# EAGLE design mSD-Shield_v20 (EAGLE 7.5.0)
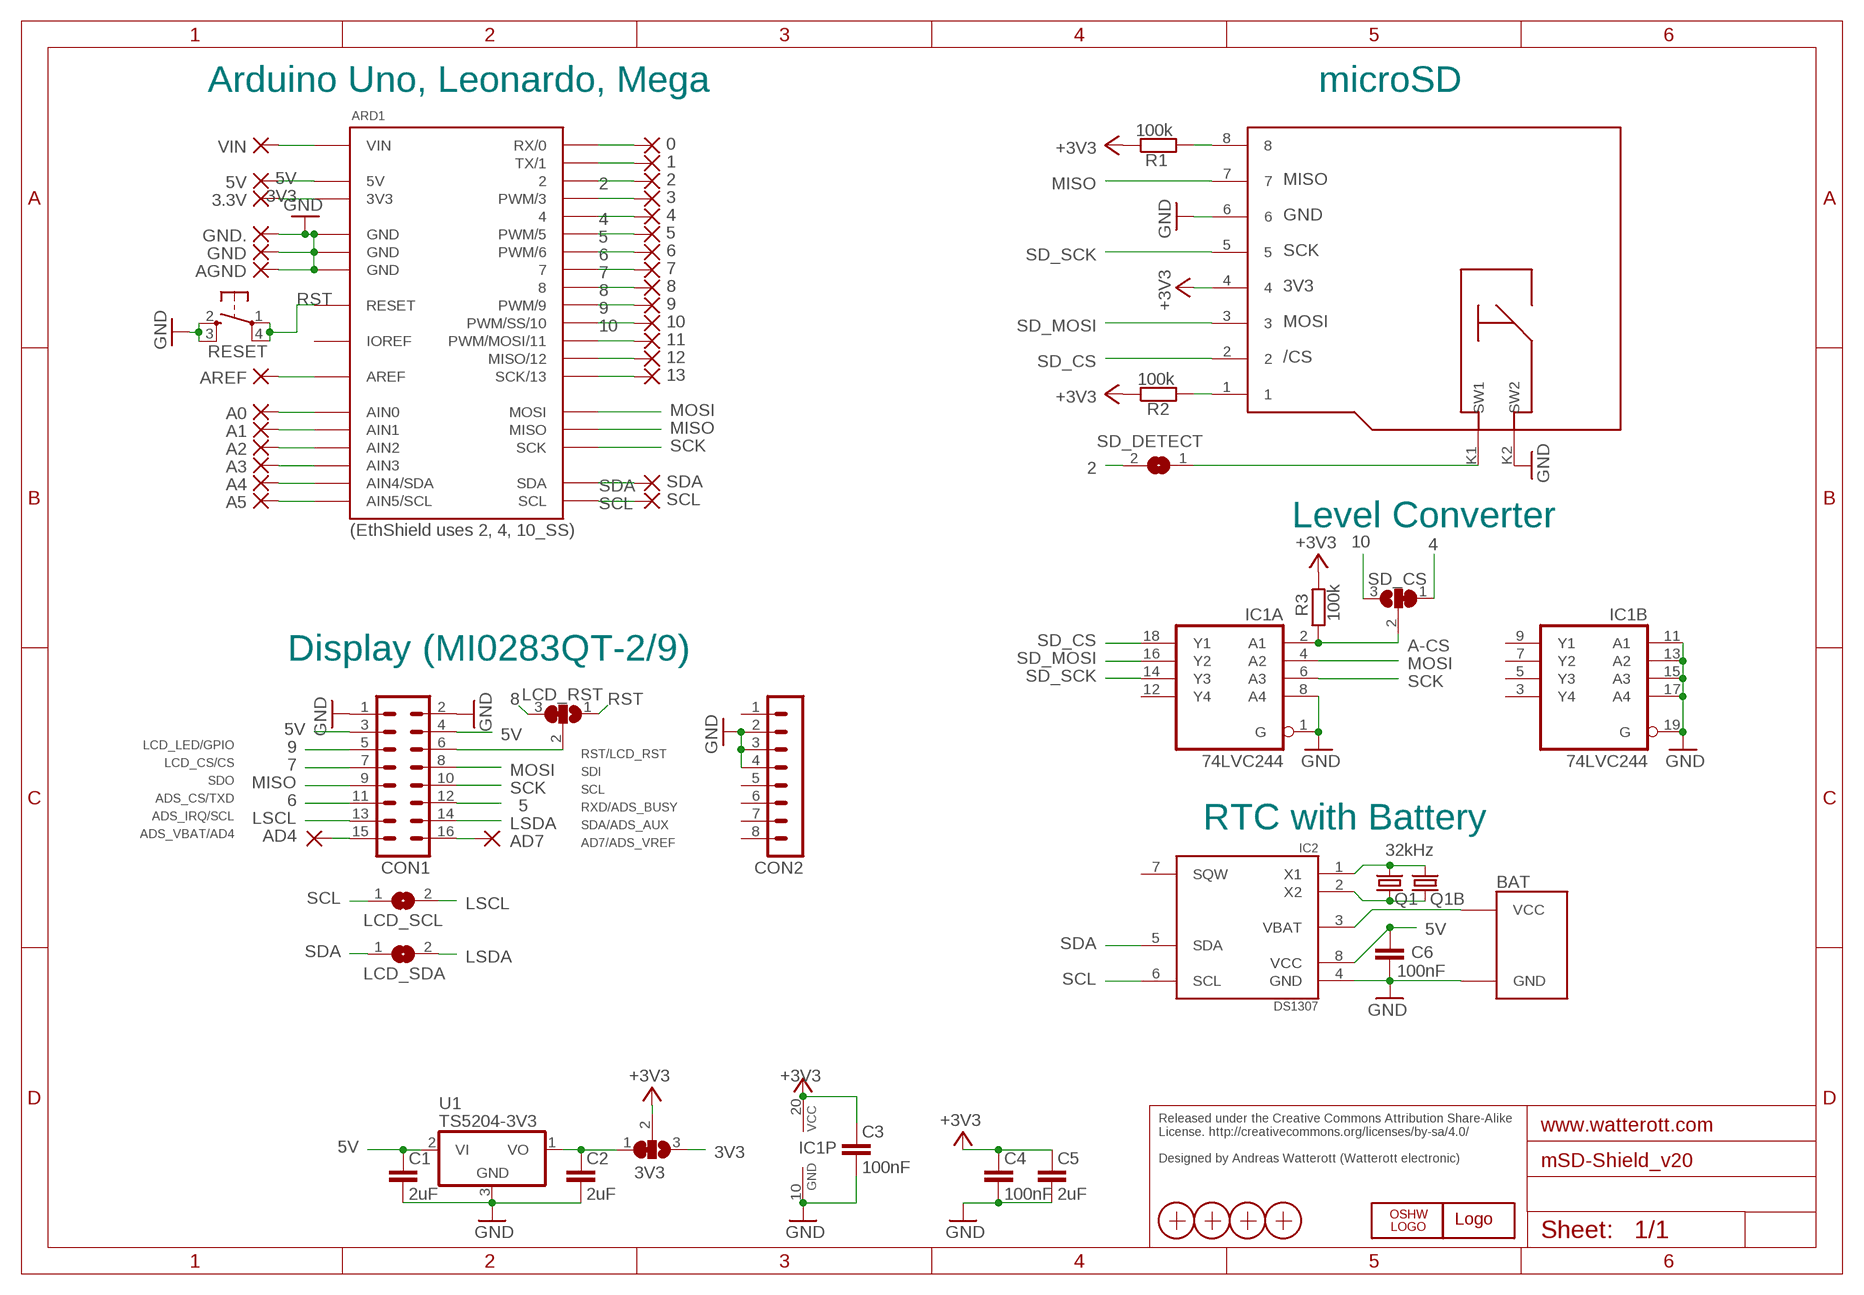
[diagram p0: schematic, sheet 1]

## Parts
0  1,6/0,8  [1,6/0,8]
1  1,6/0,8  [1,6/0,8]
2  1,6/0,8  [1,6/0,8]
3  1,6/0,8  [1,6/0,8]
3.3V  1,6/0,8  [1,6/0,8]
3V3  SJ2W  [SJ_2]
4  1,6/0,8  [1,6/0,8]
5  1,6/0,8  [1,6/0,8]
5V  1,6/0,8  [1,6/0,8]
6  1,6/0,8  [1,6/0,8]
7  1,6/0,8  [1,6/0,8]
8  1,6/0,8  [1,6/0,8]
9  1,6/0,8  [1,6/0,8]
10  1,6/0,8  [1,6/0,8]
11  1,6/0,8  [1,6/0,8]
12  1,6/0,8  [1,6/0,8]
13  1,6/0,8  [1,6/0,8]
A0  1,6/0,8  [1,6/0,8]
A1  1,6/0,8  [1,6/0,8]
A2  1,6/0,8  [1,6/0,8]
A3  1,6/0,8  [1,6/0,8]
A4  1,6/0,8  [1,6/0,8]
A5  1,6/0,8  [1,6/0,8]
AD4  1,6/0,8  [1,6/0,8]
AD7  1,6/0,8  [1,6/0,8]
AGND  1,6/0,8  [1,6/0,8]
ARD1  UNO_ISP2  [UNO_ISP2]
AREF  1,6/0,8  [1,6/0,8]
BAT  4UC-05581  [4UC-05581]
C1  2uF  C-EUC0805  [C0805]
C2  2uF  C-EUC0805  [C0805]
C3  100nF  C-EUC0603  [C0603]
C4  100nF  C-EUC0603  [C0603]
C5  2uF  C-EUC0603  [C0603]
C6  100nF  C-EUC0603  [C0603]
CON1  MA08-2  [MA08-2]
CON2  MA08-1  [MA08-1]
GND  1,6/0,8  [1,6/0,8]
GND.  1,6/0,8  [1,6/0,8]
IC1  74LVC244  74HC244DW  [SO20W]
IC2  DS1307  [SO8]
LCD_RST  SJ2W  [SJ_2]
LCD_SCL  SJ  [SJ]
LCD_SDA  SJ  [SJ]
LOGO2  WE-LOGOPLACE  [WE-LOGO]
LOGO3  OSHW_LOGO_6MILX0100-NT  [OSHW_6X100_NOTEXT]
Q1  32kHz  CRYSTALTC26V  [TC26V]
Q1B  32kHz  CRYSTALZM315  [ZM315]
R1  100k  R-EU_R0603  [R0603]
R2  100k  R-EU_R0603  [R0603]
R3  100k  R-EU_R0603  [R0603]
RESET  SW4S  [SW_SMD4]
SCL  1,6/0,8  [1,6/0,8]
SD_CS  SJ2W  [SJ_2]
SD_DETECT  SJ  [SJ]
SDA  1,6/0,8  [1,6/0,8]
U1  TS5204-3V3  TS5204  [SOT23]
VIN  1,6/0,8  [1,6/0,8]
X1  PASSER  [PASSER]
X2  PASSER  [PASSER]
X3  PASSER  [PASSER]
X4  PASSER  [PASSER]
X5  MICRO-SD  [MICRO-SD]

## Nets
0: 0.1(P) ARD1.0(RX/0)
1: 1.1(P) ARD1.1(TX/1)
2: 2.1(P) ARD1.2 SD_DETECT.2
3: 3.1(P) ARD1.3(PWM/3)
3V3: 3.3V.1(P) 3V3.3 ARD1.3V3
3V_OUT: 3V3.1 C2.1 U1.1(VO)
4: 4.1(P) ARD1.4 SD_CS.1
5: 5.1(P) ARD1.5(PWM/5) CON1.12
5V: 5V.1(P) ARD1.5V C1.1 C6.2 CON1.3 CON1.4 IC2.8(VCC) U1.2(VI)
6: 6.1(P) ARD1.6(PWM/6) CON1.11
7: 7.1(P) ARD1.7 CON1.7
8: 8.1(P) ARD1.8 LCD_RST.3
9: 9.1(P) ARD1.9(PWM/9) CON1.5
10: 10.1(P) ARD1.10(PWM/SS/10) SD_CS.3
11: 11.1(P) ARD1.11(PWM/MOSI/11)
12: 12.1(P) ARD1.12(MISO/12)
13: 13.1(P) ARD1.13(SCK/13)
+3V3: 3V3.2 C3.1 C4.1 C5.1 IC1.20(P:VCC) R1.1 R2.1 R3.2 X5.4
A-CS: IC1.2(A:A1) R3.1 SD_CS.2
AD4: AD4.1(P) CON1.15
AD7: AD7.1(P) CON1.16
AIN0: A0.1(P) ARD1.AIN0
AIN1: A1.1(P) ARD1.AIN1
AIN2: A2.1(P) ARD1.AIN2
AIN3: A3.1(P) ARD1.AIN3
AIN4: A4.1(P) ARD1.AIN4(AIN4/SDA)
AIN5: A5.1(P) ARD1.AIN5(AIN5/SCL)
AREF: ARD1.AREF AREF.1(P)
GND: AGND.1(P) ARD1.GND@1(GND) ARD1.GND@2(GND) ARD1.GND@3(GND) BAT.GND C1.2 C2.2 C3.2 C4.2 C5.2 C6.1 CON1.1 CON1.2 CON2.2 CON2.3 CON2.4 GND.1(P) GND..1(P) IC1.1(A:G) IC1.8(A:A4) IC1.10(P:GND) IC1.11(B:A1) IC1.13(B:A2) IC1.15(B:A3) IC1.17(B:A4) IC1.19(B:G) IC2.4(GND) RESET.2(S) RESET.3(S1) U1.3(GND) X5.6 X5.K2(SW2)
LCD_RST: CON1.6 LCD_RST.2
LSCL: CON1.13 LCD_SCL.2
LSDA: CON1.14 LCD_SDA.2
MISO: ARD1.MISO CON1.9 X5.7
MOSI: ARD1.MOSI CON1.8 IC1.4(A:A2)
N$16: R2.2 X5.1
N$17: R1.2 X5.8
RST: ARD1.RST(RESET) LCD_RST.1 RESET.1(P) RESET.4(P1)
SCK: ARD1.SCK CON1.10 IC1.6(A:A3)
SCL: ARD1.SCL IC2.6(SCL) LCD_SCL.1 SCL.1(P)
SD_CS: IC1.18(A:Y1) X5.2
SD_DET: SD_DETECT.1 X5.K1(SW1)
SD_MOSI: IC1.16(A:Y2) X5.3
SD_SCK: IC1.14(A:Y3) X5.5
SDA: ARD1.SDA IC2.5(SDA) LCD_SDA.1 SDA.1(P)
VBAT: BAT.VCC IC2.3(VBAT)
VIN: ARD1.VIN VIN.1(P)
X1: IC2.1(X1) Q1.2 Q1B.2
X2: IC2.2(X2) Q1.1 Q1B.1
Unconnected: CON2.1 CON2.5 CON2.6 CON2.7 CON2.8 IC1.3(B:Y4) IC1.5(B:Y3) IC1.7(B:Y2) IC1.9(B:Y1) IC1.12(A:Y4) IC2.7(SQW)

## Notes on the sheet
- Arduino Uno, Leonardo, Mega | microSD
- Level Converter
- (EthShield uses 2, 4, 10_SS)
- Display (MI0283QT-2/9)
- LCD_LED/GPIO
- LCD_CS/CS | RST/LCD_RST
- SDO | SDI
- ADS_CS/TXD | SCL
- ADS_IRQ/SCL | RXD/ADS_BUSY
- ADS_VBAT/AD4 | SDA/ADS_AUX | RTC with Battery
- AD7/ADS_VREF
- Released under the Creative Commons Attribution Share-Alike 
  License. http://creativecommons.org/licenses/by-sa/4.0/
  
  Designed by Andreas Watterott (Watterott electronic)

## Power pins joined to a net without a drawn wire
IOREF: ARD1.IOREF

## Library data of the parts
0 1-3 3.3V 4 5 5V 6-13 A0 A1-A5 AD4 AD7 AGND AREF GND GND. SCL SDA VIN = wirepad:1,6/0,8: THROUGH-HOLE PAD
3V3 LCD_RST SD_CS = jumper:SJ2W: SMD solder JUMPER
ARD1 = Arduino:UNO_ISP: Arduino UNO
BAT = Voltage-Reg:4UC-05581: CR2032 Battery Holder
C1-C6 = rcl:C-EU: CAPACITOR, European symbol
CON1 = con-lstb:MA08-2: PIN HEADER
CON2 = con-lstb:MA08-1: PIN HEADER
IC1 = 74xx-eu:74*244: Octal BUFFER and LINE DRIVER, 3-state
IC2 = RTC:DS1307
LCD_SCL LCD_SDA SD_DETECT = jumper:SJ: SMD solder JUMPER
LOGO2 = welectronic:WE-LOGO
LOGO3 = OSHW:OSHW_LOGO_6MIL
Q1 Q1B = Crystal:CRYSTAL: CRYSTAL
R1-R3 = rcl:R-EU_: RESISTOR, European symbol
RESET = Switch-SMD:SW4
U1 = Voltage-Reg:TS5204
X1-X4 = SMD:PASSER
X5 = SD-Card:MICRO-SD

## Board
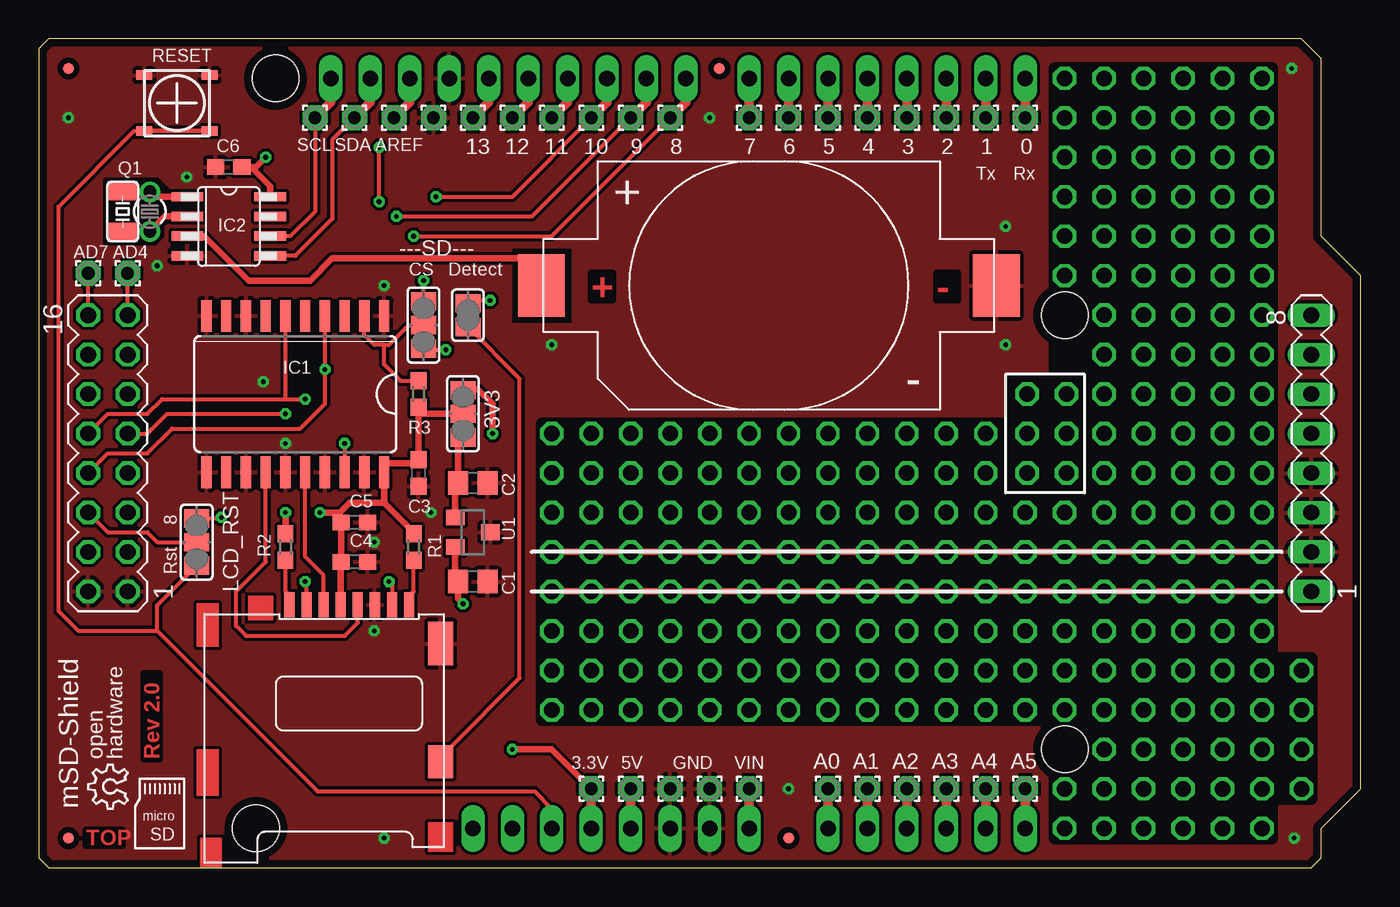
[diagram p1: board, top side]
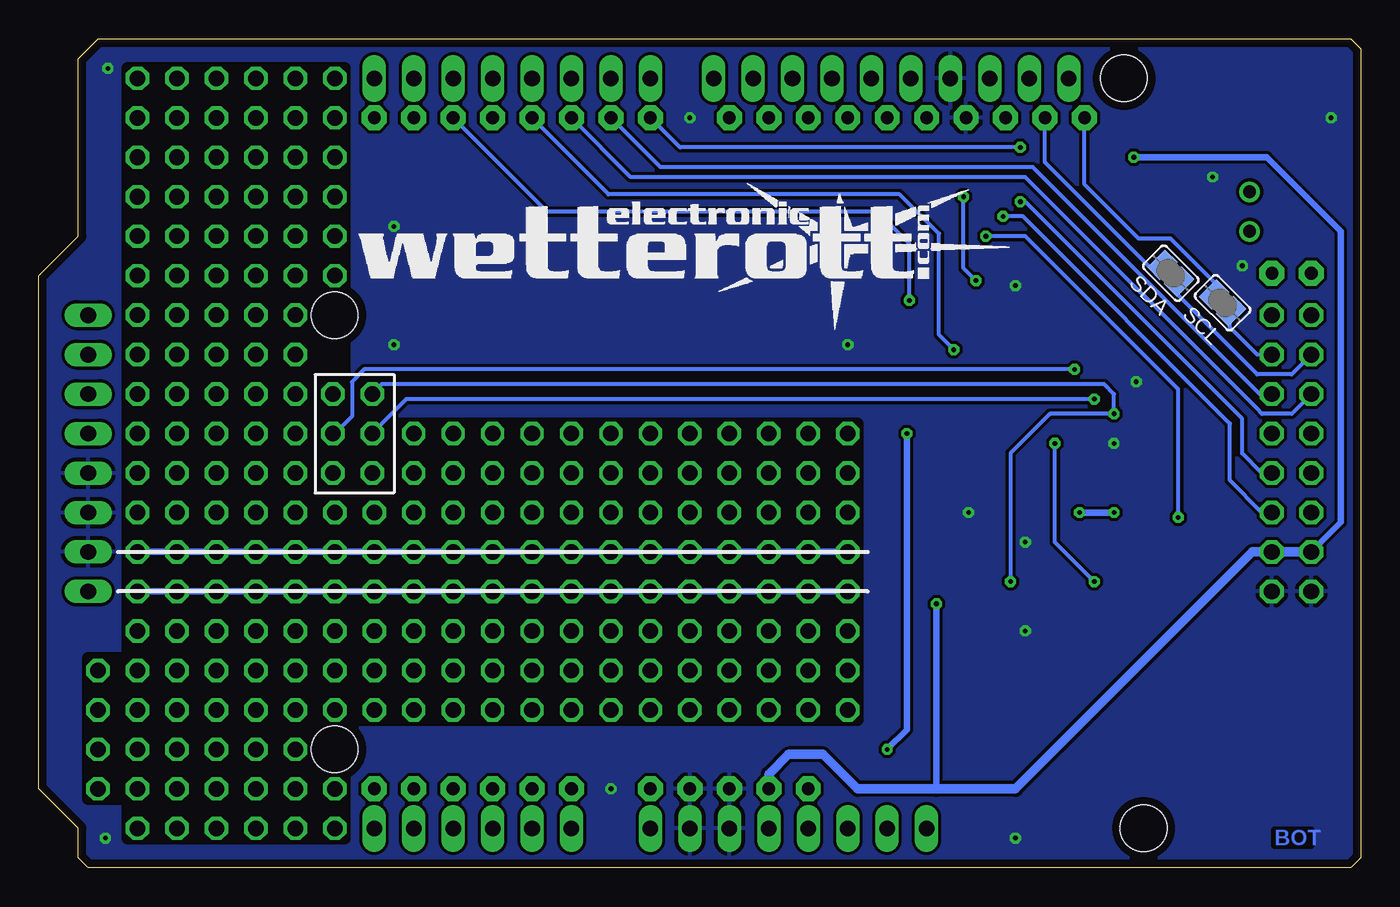
[diagram p2: board, bottom side, seen from below]

Size 85.09 x 53.34 mm. Coordinates in mm from the lower left corner, seen from the top.
Outline: 64.77,53.34 81.28,53.34 82.55,52.07 82.55,40.64 85.09,38.1 85.09,5.08 82.55,2.54 82.55,0.64 81.92,0 65.41,0
Copper layers (1*16): Top 0.035mm / dielectric 1.5mm / Bottom 0.035mm
Design rules "default *": minimum track width 8mil, minimum drill 0.3mm, track to track 8mil, track to pad 8mil, pad to pad 8mil, via to via 8mil, smd to smd 8mil, copper to edge 20mil, drill to drill 8mil, minimum pad ring 10mil, minimum via ring 8mil, stop-mask expansion 4mil, vias tented up to drill 0.5mm, thermal gap 10mil
tRestrict: area 30.5,35.1 to 34.3,39.8; area 32.4,1.9 to 81.9,51.4; area 4.3,40.2 to 10.6,44.3
bRestrict: area 32.4,1.9 to 81.9,51.4

### Footprints (pad centres in the part's own frame; a part is rotated, then mirrored left to right if it is on the bottom)
1,6/0,8 = drill 0.813 pad 1.6 octagon: 1 0,0
SJ_2 = smd 1.168 x 1.6: 1 -1.524,0; 2 0,0; 3 1.524,0
UNO_ISP2 = drill 1 long: 0 63.5,50.8; 1 60.96,50.8; 2 58.42,50.8; 3 55.88,50.8; 3V3 35.56,2.54; 4 53.34,50.8; 5 50.8,50.8; 5V 38.1,2.54; 6 48.26,50.8; 7 45.72,50.8; 8 41.656,50.8; 9 39.116,50.8; 10 36.576,50.8; 11 34.036,50.8; 12 31.496,50.8; 13 28.956,50.8; AIN0 50.8,2.54; AIN1 53.34,2.54; AIN2 55.88,2.54; AIN3 58.42,2.54; AIN4 60.96,2.54; AIN5 63.5,2.54; AREF 23.876,50.8; GND@1 40.64,2.54; GND@2 43.18,2.54; GND@3 26.416,50.8; IOREF 30.48,2.54; NC 27.94,2.54; RST 33.02,2.54; SCL 18.796,50.8; SDA 21.336,50.8; VIN 45.72,2.54 | drill 1 octagon: GND@4 66.167,25.4; MISO 63.627,30.48; MOSI 66.167,27.94; RST2 63.627,25.4; SCK 63.627,27.94; VCC 66.167,30.48 | hole 3: 66.04,35.56; 66.04,7.62; 15.24,50.8; 13.97,2.54
4UC-05581 = smd 3 x 4: GND -14.65,0; VCC 14.65,0
C0805 = smd 1.3 x 1.5: 1 -0.95,0; 2 0.95,0
C0603 = smd 1.1 x 1: 1 -0.85,0; 2 0.85,0
MA08-2 = drill 1.016 octagon: 1 -8.89,-1.27; 2 -8.89,1.27; 3 -6.35,-1.27; 4 -6.35,1.27; 5 -3.81,-1.27; 6 -3.81,1.27; 7 -1.27,-1.27; 8 -1.27,1.27; 9 1.27,-1.27; 10 1.27,1.27; 11 3.81,-1.27; 12 3.81,1.27; 13 6.35,-1.27; 14 6.35,1.27; 15 8.89,-1.27; 16 8.89,1.27
MA08-1 = drill 1.016 long: 1 -8.89,0; 2 -6.35,0; 3 -3.81,0; 4 -1.27,0; 5 1.27,0; 6 3.81,0; 7 6.35,0; 8 8.89,0
SO20W = smd 0.66 x 2.032: 1 -5.715,-5.029; 2 -4.445,-5.029; 3 -3.175,-5.029; 4 -1.905,-5.029; 5 -0.635,-5.029; 6 0.635,-5.029; 7 1.905,-5.029; 8 3.175,-5.029; 9 4.445,-5.029; 10 5.715,-5.029; 11 5.715,5.029; 12 4.445,5.029; 13 3.175,5.029; 14 1.905,5.029; 15 0.635,5.029; 16 -0.635,5.029; 17 -1.905,5.029; 18 -3.175,5.029; 19 -4.445,5.029; 20 -5.715,5.029
SO8 = smd 0.61 x 2.032: 1 -1.905,-2.667; 2 -0.635,-2.667; 3 0.635,-2.667; 4 1.905,-2.667; 5 1.905,2.667; 6 0.635,2.667; 7 -0.635,2.667; 8 -1.905,2.667
SJ = smd 1.168 x 1.6: 1 -0.762,0; 2 0.762,0
TC26V = drill 0.813: 1 -1.27,0; 2 1.27,0
ZM315 = smd 1.2 x 1.9: 1 -1.333,0; 2 1.333,0
R0603 = smd 1.1 x 1: 1 -0.85,0; 2 0.85,0
SW_SMD4 = smd 0.61 x 1.016: 1 -1.8,-2.1; 2 1.8,-2.1; 3 1.8,2.1; 4 -1.8,2.1
SOT23 = smd 1 x 1.2: 1 -0.95,-1.132; 2 0.95,-1.132; 3 0,1.132
PASSER = smd 0.7 x 0.7: X 0,0
MICRO-SD = smd 0.65 x 1.6: 1 -10.54,16.6; 2 -9.44,16.6; 3 -8.34,16.6; 4 -7.24,16.6; 5 -6.14,16.6; 6 -5.04,16.6; 7 -3.94,16.6; 8 -2.84,16.6 | smd 1.6 x 2.1: K1 -0.8,6.5 | smd 1.6 x 2.8: K2 -0.8,14.1

### Placement (x,y rotation side)
0  63.5,48.26 0 top
1  60.96,48.26 0 top
2  58.42,48.26 0 top
3  55.88,48.26 0 top
3.3V  35.56,5.08 0 top
3V3  27.3,29.21 90 top
4  53.34,48.26 0 top
5  50.8,48.26 0 top
5V  38.1,5.08 0 top
6  48.26,48.26 0 top
7  45.72,48.26 0 top
8  40.64,48.26 0 top
9  38.1,48.26 0 top
10  35.56,48.26 0 top
11  33.02,48.26 0 top
12  30.48,48.26 0 top
13  27.94,48.26 0 top
A0  50.8,5.08 180 top
A1  53.34,5.08 180 top
A2  55.88,5.08 180 top
A3  58.42,5.08 180 top
A4  60.96,5.08 180 top
A5  63.5,5.08 180 top
AD4  5.71,38.26 0 top
AD7  3.17,38.26 0 top
AGND  25.4,48.26 0 top
ARD1  0,0 0 top
AREF  22.86,48.26 0 top
BAT  46.99,37.47 180 top
C1  27.94,18.41 0 top
C2  27.94,24.77 0 top
C3  24.45,25.4 270 top
C4  20.32,19.68 0 top
C5  20.32,22.23 0 top
C6  12.22,45.09 0 top
CON1  4.45,26.67 90 top
CON2  81.92,26.67 90 top
GND  43.18,5.08 0 top
GND.  40.64,5.08 0 top
IC1  16.51,30.48 180 top
IC2  12.22,41.27 270 top
LCD_RST  10.16,20.95 90 top
LCD_SCL  8.89,36.35 315 bottom
LCD_SDA  12.22,38.26 315 bottom
LOGO2  64.77,34.29 0 bottom
LOGO3  5.71,3.81 90 top
Q1  7.14,42.23 90 top
Q1B  5.4,42.23 90 top
R1  24.13,20.64 270 top
R2  15.88,20.64 270 top
R3  24.45,30.48 270 top
RESET  8.89,49.21 90 top
SCL  17.78,48.26 0 top
SD_CS  24.77,34.92 90 top
SD_DETECT  27.62,35.56 90 top
SDA  20.32,48.26 0 top
U1  27.94,21.59 270 top
VIN  45.72,5.08 0 top
X1  1.91,1.91 0 top
X2  1.91,51.44 0 top
X3  43.81,51.44 0 top
X4  48.26,1.91 0 top
X5  26.67,0.32 0 top

### Tracks (layer width: path | path; a pad name or v marks a point on that pad's centre or on a via)
0
  Top 0.61: 0.1 ARD1.0
1
  Top 0.61: 1.1 ARD1.1
2  (via drill 0.3)
  Top 0.254: v29.05,36.51 27.81,36.51 SD_DETECT.2
  Top 0.61: 2.1 ARD1.2
  Bottom 0.254: 2.1 52.39,42.23 31.11,42.23 29.05,40.16 v29.05,36.51
3
  Top 0.61: 3.1 ARD1.3
3V3  (via drill 0.3)
  Top 0.254: 27.37,30.8 3V3.3
  Top 0.406: v29.21,27.94 29.21,29.84 28.26,30.8 27.37,30.8 | v30.48,7.62 33.02,7.62 3.3V.1
  Top 0.61: 3.3V.1 ARD1.3V3
  Bottom 0.406: v30.48,7.62 29.21,8.89 v29.21,27.94
3V_OUT
  Top 0.254: 26.81,24.58 C2.1 | 26.99,27.37 3V3.1
  Top 0.406: U1.1 26.81,24.58 | C2.1 26.99,27.37
4  (via drill 0.3)
  Top 0.254: v26.19,33.34 24.83,33.34 SD_CS.1
  Top 0.61: 4.1 ARD1.4
  Bottom 0.254: 4.1 48.42,43.34 29.69,43.34 27.15,40.8 27.15,34.29 v26.19,33.34
5
  Top 0.61: 5.1 ARD1.5
  Bottom 0.254: CON1.12 4.45,29.21 6.35,29.21 6.51,29.37 21.59,44.45 46.99,44.45 5.1
5V  (via drill 0.3)
  Top 0.254: C1.1 26.81,18.6
  Top 0.406: 26.81,18.6 U1.2 | IC2.8 14.89,43.85 13.65,45.09 | 13.65,45.09 C6.2 | 13.65,45.09 13.97,45.09 v14.61,45.72 | C1.1 26.99,17.3 v27.3,16.99
  Top 0.61: 5V.1 ARD1.5V | 5V.1
  Bottom 0.406: 27.3,5.08 v27.3,16.99 | v14.61,45.72 6.03,45.72 1.27,40.96 1.27,22.23 CON1.4
  Bottom 0.61: 5V.1 38.1,6.03 36.83,7.3 34.61,7.3 32.38,5.08 27.3,5.08 22.23,5.08 6.99,20.32 CON1.3 CON1.4 | 5V.1
6
  Top 0.61: 6.1 ARD1.6
  Bottom 0.254: 6.1 45.09,45.09 21.11,45.09 6.51,30.48 CON1.11
7  (via drill 0.3)
  Top 0.254: v21.91,42.86 v21.91,46.35
  Top 0.61: 7.1 ARD1.7
  Bottom 0.254: 7.1 43.81,46.35 v21.91,46.35 | v21.91,42.86 21.59,42.86 7.62,28.89 7.62,26.67 6.35,25.4 CON1.7
8  (via drill 0.3)
  Top 0.254: v24.13,40.64 33.02,40.64 8.1 | LCD_RST.3 11.68,22.48 v11.75,22.54
  Top 0.61: ARD1.8 41.66,49.28 8.1
  Bottom 0.254: v11.75,22.54 11.75,30.8 21.59,40.64 v24.13,40.64
9  (via drill 0.3)
  Top 0.254: v23.02,41.91 31.75,41.91 9.1
  Top 0.61: ARD1.9 39.12,49.28 9.1
  Bottom 0.254: CON1.5 6.35,22.86 8.41,24.92 8.41,28.57 21.75,41.91 v23.02,41.91
10  (via drill 0.3)
  Top 0.254: SD_CS.3 v24.77,37.78 | v25.56,43.18 30.48,43.18 10.1
  Top 0.61: ARD1.10 36.58,49.28 10.1
  Bottom 0.254: v24.77,37.78 25.56,38.58 v25.56,43.18
11
  Top 0.61: ARD1.11 34.04,49.28 11.1
12
  Top 0.61: ARD1.12 31.5,49.28 12.1
13
  Top 0.61: ARD1.13 28.96,49.28 13.1
+3V3  (via drill 0.3)
  Top 0.254: C5.1 19.37,22.23 | 24.45,29.21 R3.2 | IC1.20 22.23,26.04 | 24.23,26.04 C3.1 | 24.13,21.59 R1.1 | 3V3.2 27.3,27.62
  Top 0.406: v15.88,22.86 R2.1 | 19.37,22.23 19.37,22.86 | 19.37,22.86 20,23.5 22.23,23.5 | 22.23,23.5 IC1.20 | C3.1 24.45,29.21 3V3.2 | 22.23,26.04 24.23,26.04 | 22.23,23.5 24.13,21.59 | 19.37,22.86 v18.1,22.86 | X5.4 19.43,19.64 C4.1 C5.1
  Bottom 0.406: v18.1,22.86 v15.88,22.86
A-CS
  Top 0.254: 22.23,33.66 21.59,33.66 20.95,34.29 IC1.2 | 22.23,33.66 22.54,33.66 23.81,34.92 SD_CS.2 24.77,33.34 | R3.1 23.28,31.33 22.23,32.38 22.23,33.66
AD4
  Top 0.254: CON1.15 AD4.1
AD7
  Top 0.254: CON1.16 AD7.1
AIN0
  Top 0.61: ARD1.AIN0 A0.1
AIN1
  Top 0.61: ARD1.AIN1 A1.1
AIN2
  Top 0.61: ARD1.AIN2 A2.1
AIN3
  Top 0.61: ARD1.AIN3 A3.1
AIN4
  Top 0.61: ARD1.AIN4 A4.1
AIN5
  Top 0.61: ARD1.AIN5 A5.1
AREF
  Top 0.61: ARD1.AREF 23.88,49.28 AREF.1
COM1  (via drill 1)
  Top 0.406: v33.02,20.32 v78.74,20.32
  Bottom 0.406: v33.02,20.32 v35.56,20.32 v38.1,20.32 v40.64,20.32 v43.18,20.32 v45.72,20.32 v48.26,20.32 v50.8,20.32 v53.34,20.32 v55.88,20.32 v58.42,20.32 v60.96,20.32 v63.5,20.32 v66.04,20.32 v68.58,20.32 v71.12,20.32 v73.66,20.32 v76.2,20.32 v78.74,20.32
COM2  (via drill 1)
  Top 0.406: v33.02,17.78 v78.74,17.78
  Bottom 0.406: v33.02,17.78 v35.56,17.78 v38.1,17.78 v40.64,17.78 v43.18,17.78 v45.72,17.78 v48.26,17.78 v50.8,17.78 v53.34,17.78 v55.88,17.78 v58.42,17.78 v60.96,17.78 v63.5,17.78 v66.04,17.78 v68.58,17.78 v71.12,17.78 v73.66,17.78 v76.2,17.78 v78.74,17.78
GND  (via drill 0.3)
  other vias: 21.59,20.95 22.23,37.47 1.91,48.26 80.64,51.44 33.02,33.66 80.8,1.91 48.26,5.08 43.18,48.26 22.23,1.91 9.53,44.45 15.88,27.3 7.62,38.73 21.59,15.24 62.23,41.27 62.23,33.66 14.45,31.27 25.24,22.86
  pour Bottom: 0,53.34 85.09,53.34 85.09,0 0,0
  pour Top: 0,0 0,53.34 85.09,53.34 85.09,0
LCD_RST
  Top 0.254: CON1.6 4.45,21.59 6.99,21.59 7.62,20.95 LCD_RST.2
LSCL
  Bottom 0.254: CON1.13 6.67,33.02 8.41,34.77 8.41,35.75 LCD_SCL.2
LSDA
  Bottom 0.254: CON1.14 4.45,31.75 6.67,31.75 11.91,36.99 11.91,37.5 LCD_SDA.2
MISO  (via drill 0.3)
  Top 0.254: X5.7 22.73,18.23 v22.54,18.41 | CON1.9 6.99,27.94 8.26,29.21 v15.88,29.21
  Bottom 0.254: ARD1.MISO 63.66,30.48 63.02,31.11 16.51,31.11 15.88,30.48 v15.88,29.21 20,29.21 22.54,26.67 v22.54,18.41
MOSI  (via drill 0.3)
  Top 0.254: CON1.8 4.45,26.67 6.99,26.67 8.57,28.26 16.83,28.26 18.41,29.84 v18.41,32.07 IC1.4
  Bottom 0.254: ARD1.MOSI 66.04,27.94 64.93,29.05 64.93,31.27 64.14,32.07 v18.41,32.07
N$1  (via drill 1)
  other vias: 33.02,10.16
N$2  (via drill 1)
  other vias: 35.56,10.16
N$3  (via drill 1)
  other vias: 38.1,10.16
N$4  (via drill 1)
  other vias: 40.64,10.16
N$5  (via drill 1)
  other vias: 43.18,10.16
N$6  (via drill 1)
  other vias: 45.72,10.16
N$7  (via drill 1)
  other vias: 48.26,10.16
N$8  (via drill 1)
  other vias: 50.8,10.16
N$9  (via drill 1)
  other vias: 58.42,12.7
N$10  (via drill 1)
  other vias: 58.42,15.24
N$11
  Top 0.254: 10.16,22.54 10.16,20.95
N$13  (via drill 1)
  other vias: 58.42,22.86
N$14  (via drill 1)
  other vias: 58.42,25.4
N$15  (via drill 1)
  other vias: 58.42,27.94
N$16
  Top 0.254: X5.1 16.13,17.52 15.88,17.78 R2.2
N$17
  Top 0.254: X5.8 23.83,17.48 24.13,17.78 R1.2
N$19  (via drill 1)
  other vias: 53.34,10.16
N$20  (via drill 1)
  other vias: 55.88,10.16
N$21  (via drill 1)
  other vias: 58.42,10.16
N$22  (via drill 1)
  other vias: 60.96,10.16
N$23  (via drill 1)
  other vias: 66.04,50.8
N$24  (via drill 1)
  other vias: 66.04,2.54
N$25  (via drill 1)
  other vias: 68.58,12.7
N$26  (via drill 1)
  other vias: 71.12,12.7
N$27  (via drill 1)
  other vias: 60.96,12.7
N$28  (via drill 1)
  other vias: 60.96,15.24
N$31  (via drill 1)
  other vias: 60.96,22.86
N$40  (via drill 1)
  other vias: 63.5,15.24
N$41  (via drill 1)
  other vias: 73.66,12.7
N$42  (via drill 1)
  other vias: 76.2,12.7
N$43  (via drill 1)
  other vias: 33.02,12.7
N$44  (via drill 1)
  other vias: 33.02,15.24
N$47  (via drill 1)
  other vias: 33.02,22.86
N$48  (via drill 1)
  other vias: 33.02,25.4
N$49  (via drill 1)
  other vias: 33.02,27.94
N$50  (via drill 1)
  other vias: 66.04,15.24
N$51  (via drill 1)
  other vias: 63.5,12.7
N$52  (via drill 1)
  other vias: 66.04,12.7
N$53  (via drill 1)
  other vias: 63.5,10.16
N$54  (via drill 1)
  other vias: 66.04,10.16
N$55  (via drill 1)
  other vias: 68.58,10.16
N$56  (via drill 1)
  other vias: 71.12,10.16
N$57  (via drill 1)
  other vias: 73.66,10.16
N$58  (via drill 1)
  other vias: 76.2,10.16
N$59  (via drill 1)
  other vias: 55.88,12.7
N$60  (via drill 1)
  other vias: 55.88,15.24
N$63  (via drill 1)
  other vias: 55.88,22.86
N$64  (via drill 1)
  other vias: 55.88,25.4
N$65  (via drill 1)
  other vias: 55.88,27.94
N$66  (via drill 1)
  other vias: 78.74,10.16
N$67  (via drill 1)
  other vias: 78.74,12.7
N$68  (via drill 1)
  other vias: 71.12,7.62
N$69  (via drill 1)
  other vias: 71.12,5.08
N$70  (via drill 1)
  other vias: 68.58,5.08
N$71  (via drill 1)
  other vias: 68.58,7.62
N$72  (via drill 1)
  other vias: 73.66,7.62
N$73  (via drill 1)
  other vias: 73.66,5.08
N$74  (via drill 1)
  other vias: 68.58,2.54
N$75  (via drill 1)
  other vias: 53.34,12.7
N$76  (via drill 1)
  other vias: 53.34,15.24
N$79  (via drill 1)
  other vias: 53.34,22.86
N$80  (via drill 1)
  other vias: 53.34,25.4
N$81  (via drill 1)
  other vias: 53.34,27.94
N$82  (via drill 1)
  other vias: 71.12,2.54
N$83  (via drill 1)
  other vias: 73.66,2.54
N$84  (via drill 1)
  other vias: 76.2,2.54
N$85  (via drill 1)
  other vias: 76.2,5.08
N$86  (via drill 1)
  other vias: 76.2,7.62
N$87  (via drill 1)
  other vias: 78.74,7.62
N$88  (via drill 1)
  other vias: 78.74,5.08
N$89  (via drill 1)
  other vias: 78.74,2.54
N$90  (via drill 1)
  other vias: 81.28,5.08
N$91  (via drill 1)
  other vias: 50.8,12.7
N$92  (via drill 1)
  other vias: 50.8,15.24
N$95  (via drill 1)
  other vias: 50.8,22.86
N$96  (via drill 1)
  other vias: 50.8,25.4
N$97  (via drill 1)
  other vias: 50.8,27.94
N$98  (via drill 1)
  other vias: 81.28,7.62
N$99  (via drill 1)
  other vias: 81.28,10.16
N$100  (via drill 1)
  other vias: 81.28,12.7
N$101  (via drill 1)
  other vias: 78.74,15.24
N$104  (via drill 1)
  other vias: 78.74,22.86
N$105  (via drill 1)
  other vias: 78.74,25.4
N$106  (via drill 1)
  other vias: 78.74,27.94
N$107  (via drill 1)
  other vias: 48.26,12.7
N$108  (via drill 1)
  other vias: 48.26,15.24
N$111  (via drill 1)
  other vias: 48.26,22.86
N$112  (via drill 1)
  other vias: 48.26,25.4
N$113  (via drill 1)
  other vias: 48.26,27.94
N$114  (via drill 1)
  other vias: 78.74,30.48
N$115  (via drill 1)
  other vias: 78.74,33.02
N$116  (via drill 1)
  other vias: 78.74,35.56
N$117  (via drill 1)
  other vias: 78.74,38.1
N$118  (via drill 1)
  other vias: 78.74,40.64
N$119  (via drill 1)
  other vias: 78.74,43.18
N$120  (via drill 1)
  other vias: 76.2,43.18
N$121  (via drill 1)
  other vias: 73.66,43.18
N$122  (via drill 1)
  other vias: 71.12,43.18
N$123  (via drill 1)
  other vias: 45.72,12.7
N$124  (via drill 1)
  other vias: 45.72,15.24
N$127  (via drill 1)
  other vias: 45.72,22.86
N$128  (via drill 1)
  other vias: 45.72,25.4
N$129  (via drill 1)
  other vias: 45.72,27.94
N$130  (via drill 1)
  other vias: 68.58,43.18
N$131  (via drill 1)
  other vias: 66.04,43.18
N$132  (via drill 1)
  other vias: 66.04,40.64
N$133  (via drill 1)
  other vias: 66.04,38.1
N$135  (via drill 1)
  other vias: 68.58,40.64
N$136  (via drill 1)
  other vias: 68.58,38.1
N$137  (via drill 1)
  other vias: 68.58,35.56
N$138  (via drill 1)
  other vias: 68.58,33.02
N$139  (via drill 1)
  other vias: 43.18,12.7
N$140  (via drill 1)
  other vias: 43.18,15.24
N$143  (via drill 1)
  other vias: 43.18,22.86
N$144  (via drill 1)
  other vias: 43.18,25.4
N$145  (via drill 1)
  other vias: 43.18,27.94
N$148  (via drill 1)
  other vias: 68.58,22.86
N$151  (via drill 1)
  other vias: 68.58,15.24
N$152  (via drill 1)
  other vias: 76.2,15.24
N$153  (via drill 1)
  other vias: 73.66,15.24
N$154  (via drill 1)
  other vias: 71.12,15.24
N$155  (via drill 1)
  other vias: 40.64,12.7
N$156  (via drill 1)
  other vias: 40.64,15.24
N$159  (via drill 1)
  other vias: 40.64,22.86
N$160  (via drill 1)
  other vias: 40.64,25.4
N$161  (via drill 1)
  other vias: 40.64,27.94
N$164  (via drill 1)
  other vias: 71.12,22.86
N$167  (via drill 1)
  other vias: 73.66,22.86
N$170  (via drill 1)
  other vias: 76.2,22.86
N$171  (via drill 1)
  other vias: 38.1,12.7
N$172  (via drill 1)
  other vias: 38.1,15.24
N$175  (via drill 1)
  other vias: 38.1,22.86
N$176  (via drill 1)
  other vias: 38.1,25.4
N$177  (via drill 1)
  other vias: 38.1,27.94
N$178  (via drill 1)
  other vias: 71.12,25.4
N$179  (via drill 1)
  other vias: 71.12,27.94
N$180  (via drill 1)
  other vias: 71.12,30.48
N$181  (via drill 1)
  other vias: 71.12,33.02
N$182  (via drill 1)
  other vias: 71.12,35.56
N$183  (via drill 1)
  other vias: 71.12,38.1
N$184  (via drill 1)
  other vias: 71.12,40.64
N$185  (via drill 1)
  other vias: 73.66,40.64
N$186  (via drill 1)
  other vias: 76.2,40.64
N$187  (via drill 1)
  other vias: 35.56,12.7
N$188  (via drill 1)
  other vias: 35.56,15.24
N$191  (via drill 1)
  other vias: 35.56,22.86
N$192  (via drill 1)
  other vias: 35.56,25.4
N$193  (via drill 1)
  other vias: 35.56,27.94
N$194  (via drill 1)
  other vias: 76.2,38.1
N$195  (via drill 1)
  other vias: 73.66,38.1
N$196  (via drill 1)
  other vias: 73.66,35.56
N$198  (via drill 1)
  other vias: 76.2,35.56
N$199  (via drill 1)
  other vias: 76.2,33.02
N$200  (via drill 1)
  other vias: 73.66,33.02
N$201  (via drill 1)
  other vias: 73.66,30.48
N$202  (via drill 1)
  other vias: 76.2,30.48
N$203  (via drill 1)
  other vias: 76.2,27.94
N$204  (via drill 1)
  other vias: 76.2,25.4
N$205  (via drill 1)
  other vias: 73.66,25.4
N$206  (via drill 1)
  other vias: 73.66,27.94
N$207  (via drill 1)
  other vias: 68.58,45.72
N$208  (via drill 1)
  other vias: 68.58,48.26
N$209  (via drill 1)
  other vias: 68.58,50.8
N$210  (via drill 1)
  other vias: 71.12,45.72
N$211  (via drill 1)
  other vias: 71.12,48.26
N$212  (via drill 1)
  other vias: 71.12,50.8
N$213  (via drill 1)
  other vias: 73.66,50.8
N$214  (via drill 1)
  other vias: 76.2,50.8
N$215  (via drill 1)
  other vias: 78.74,50.8
N$216  (via drill 1)
  other vias: 78.74,48.26
N$217  (via drill 1)
  other vias: 78.74,45.72
N$218  (via drill 1)
  other vias: 76.2,45.72
N$219  (via drill 1)
  other vias: 76.2,48.26
N$220  (via drill 1)
  other vias: 73.66,48.26
N$221  (via drill 1)
  other vias: 73.66,45.72
N$222  (via drill 1)
  other vias: 66.04,45.72
N$223  (via drill 1)
  other vias: 66.04,48.26
N$224  (via drill 1)
  other vias: 66.04,5.08
N$225  (via drill 1)
  other vias: 68.58,30.48
N$226  (via drill 1)
  other vias: 68.58,27.94
N$227  (via drill 1)
  other vias: 68.58,25.4
N$228  (via drill 1)
  other vias: 66.04,22.86
N$229  (via drill 1)
  other vias: 63.5,22.86
N$230  (via drill 1)
  other vias: 60.96,25.4
N$231  (via drill 1)
  other vias: 60.96,27.94
RST
  Top 0.254: RESET.4 RESET.1 6.14,47.41 1.27,42.55 1.27,16.51 2.54,15.24 7.62,15.24 | ARD1.RST 33.02,3.81 31.91,4.92 17.94,4.92 7.62,15.24 | 7.62,15.24 7.62,16.89 LCD_RST.1
SCK  (via drill 0.3)
  Top 0.254: CON1.10 4.45,29.21 6.99,29.21 7.94,30.16 15.88,30.16 | 15.88,30.16 IC1.6 | 15.88,30.16 v17.14,30.16
  Bottom 0.254: ARD1.SCK 63.66,27.94 61.44,30.16 v17.14,30.16
SCL
  Top 0.254: IC2.6 16.19,40.64 17.78,42.23 SCL.1 | SCL.1
  Top 0.61: ARD1.SCL 18.8,49.28 SCL.1
  Bottom 0.254: LCD_SCL.1 9.43,37.69 12.22,40.48 14.29,40.48 | SCL.1 17.78,43.97 14.29,40.48 | SCL.1 | 14.29,40.48
SD_CS  (via drill 0.3)
  Top 0.254: v19.68,27.3 IC1.18 | X5.2 17.23,18.33 v17.14,18.41
  Bottom 0.254: v17.14,18.41 19.68,20.95 v19.68,27.3
SD_DET
  Top 0.254: X5.K1 26.5,7.45 26.5,7.77 30.96,12.22 30.96,31.46 SD_DETECT.1
SD_MOSI
  Top 0.254: X5.3 18.33,18.82 17.14,20 IC1.16
SD_SCK
  Top 0.254: X5.5 20.53,15.77 19.68,14.92 13.34,14.92 12.7,15.56 12.7,17.78 14.61,19.68 IC1.14
SDA
  Top 0.254: SDA.1 18.89,46.83 18.89,41.75 16.51,39.37 IC2.5
  Top 0.61: ARD1.SDA 21.34,49.28 SDA.1
  Bottom 0.254: SDA.1 20.32,45.4 13.49,38.58 12.98,38.58 LCD_SDA.1
VBAT
  Top 0.254: BAT.VCC 32.38,37.51
  Top 0.406: IC2.3 10.64,40.64 13.49,37.78 17.46,37.78 18.89,39.21 31.75,39.21 31.91,39.05 31.91,37.9 BAT.VCC
VIN
  Top 0.61: ARD1.VIN VIN.1
X1
  Top 0.406: IC2.1 7.46,43.18 Q1.2 5.46,43.5 Q1B.2
X2
  Top 0.406: IC2.2 8.1,41.91 Q1.1 5.46,40.96 Q1B.1

### Text on the board
Top: + | - | Rev 2.0 | TOP
Bottom: BOT
tPlace: Tx | Rx | ---SD--- | CS | Detect | 8 | Rst | open | hardware | mSD-Shield | micro | SD
bPlace: SDA | SCL
Reference: Silkscreen: 21 tPlace + 25 tNames + 22 bPlace